# Altium project RGB_Plugin_Board.PrjPCB
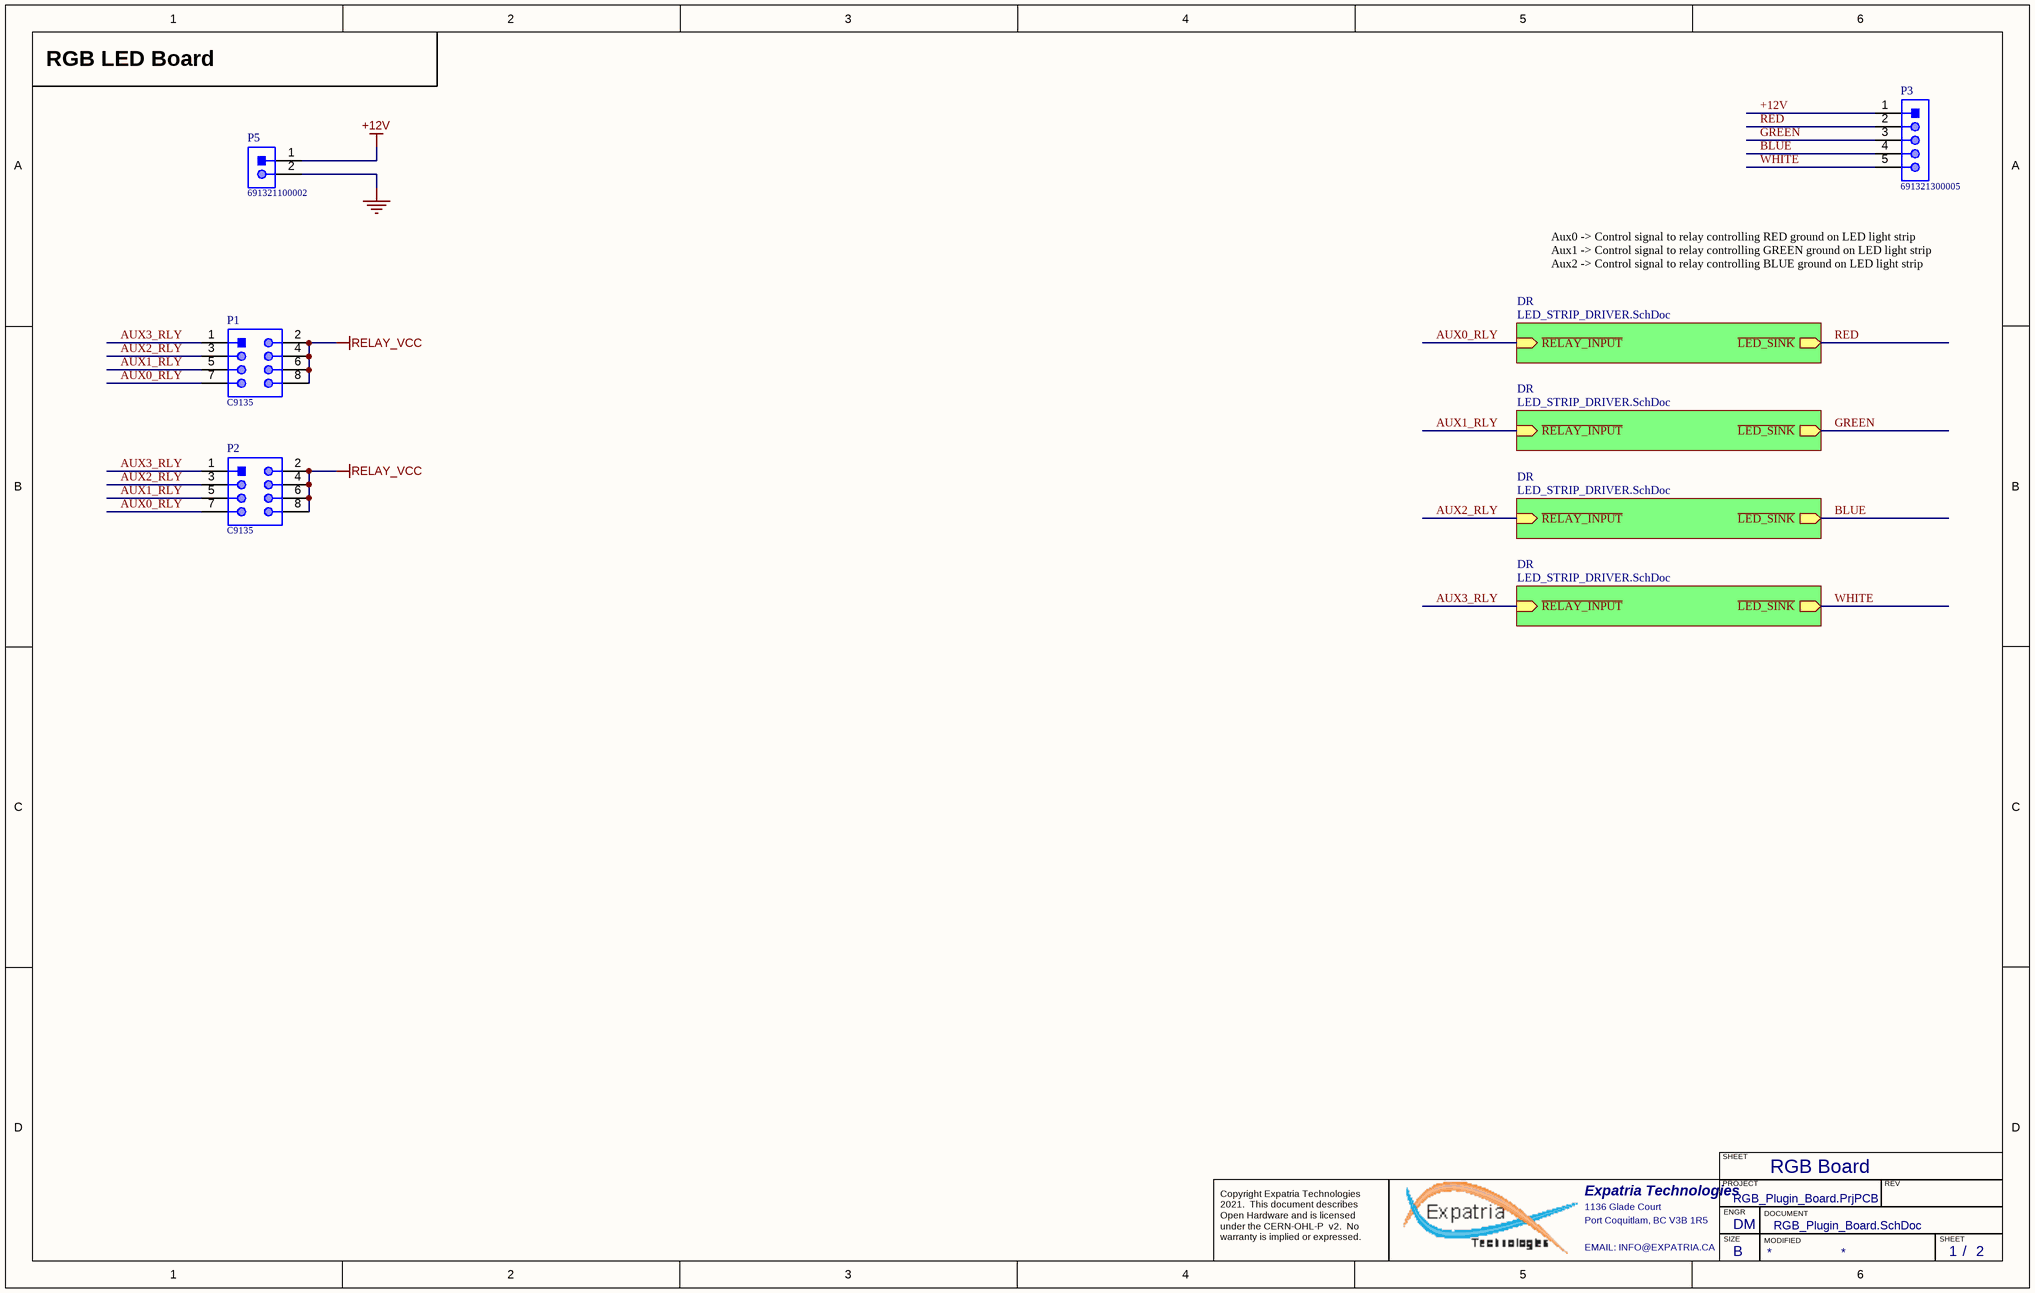
[diagram p0: RGB_Plugin_Board.SchDoc]
PCBPARTNO: RGB_PLUGIN; PCBREVNO: A2; Title: RGB_PLUGIN; VarRevNo: A2
2 sheets, 20 parts. Net scope: hierarchical (ports join the sheet entries above them; power ports are global).
Board file: RGB_Plugin_Board.PcbDoc
Sheets:
  RGB_Plugin_Board.SchDoc
    DR = LED_STRIP_DRIVER.SchDoc
    DR = LED_STRIP_DRIVER.SchDoc
    DR = LED_STRIP_DRIVER.SchDoc
    DR = LED_STRIP_DRIVER.SchDoc

## Sheet RGB_Plugin_Board.SchDoc: Bluebell MFG PCB
size B; Author: AM; CompanyName: Cambridge Mobile Telematics; DrawnBy: A.Marles; Engineer: DM; Organization: Silver Bullet Technology; Address1: Schematic; Address2: 101 Main Street, 14th Floor; Address3: Cambridge, MA 02142; Address4: USA; DocumentNumber: 1; Revision: A2; SheetNumber: 1; SheetTotal: 2

### Parts
P1  C9135  [61200821621]
P2  C9135  [61200821621]
P3  691321300005  [691321300005]
P5  691321100002  [691321100002]

### Sub-sheets
DR = LED_STRIP_DRIVER.SchDoc: ~{LED_SINK} (out), ~{RELAY_INPUT} (in)
DR = LED_STRIP_DRIVER.SchDoc: ~{LED_SINK} (out), ~{RELAY_INPUT} (in)
DR = LED_STRIP_DRIVER.SchDoc: ~{LED_SINK} (out), ~{RELAY_INPUT} (in)
DR = LED_STRIP_DRIVER.SchDoc: ~{LED_SINK} (out), ~{RELAY_INPUT} (in)

### Nets
+12V: P3.1 P5.1
GND: P5.2
RELAY_VCC: P1.2 P1.4 P1.6 P1.8 P2.2 P2.4 P2.6 P2.8
AUX0_RLY: P1.7 P2.7 ; sheet DR/~{RELAY_INPUT}
AUX1_RLY: P1.5 P2.5 ; sheet DR/~{RELAY_INPUT}
AUX2_RLY: P1.3 P2.3 ; sheet DR/~{RELAY_INPUT}
AUX3_RLY: P1.1 P2.1 ; sheet DR/~{RELAY_INPUT}
BLUE: P3.4 ; sheet DR/~{LED_SINK}
GREEN: P3.3 ; sheet DR/~{LED_SINK}
RED: P3.2 ; sheet DR/~{LED_SINK}
WHITE: P3.5 ; sheet DR/~{LED_SINK}

### Notes on the sheet
- RGB LED Board
- Aux0 -> Control signal to relay controlling RED ground on LED light strip
  Aux1 -> Control signal to relay controlling GREEN ground on LED light strip
  Aux2 -> Control signal to relay controlling BLUE ground on LED light strip
- RGB Board
- SHEET
- Expatria Technologies
- 1136 Glade Court
- Port Coquitlam, BC V3B 1R5
- PROJECT
- SIZE
- ENGR
- MODIFIED
- DOCUMENT
- REV
- Copyright Expatria Technologies 2021.  This document describes Open Hardware and is licensed under the CERN-OHL-P  v2.  No warranty is implied or expressed.
- EMAIL: INFO@EXPATRIA.CA
- B
- /

### Library data of the parts
P1 P2 = CMP-1502-00006-1: Male Box Header WR-BHD, THT, Vertical, pitch 2.54 mm, 8 pins; Manufacturer: Wurth Elektronik; Pitch: 2.54mm; Publisher: WurthElektronik; Part Number: C9135; Packaging: Tray; Published Date: August2018; Package Reference: 61200821621; SuppliersPartNumber: C9135
P3 = CMP-1502-01866-1: Serie 321 - 3.81mm Vertical PCB Header WR-TBL, 5 pin; Manufacturer: Wurth Elektronik; Gender: Male; Pin Number: 5; Packaging: Box; Package Reference: 691321300005; Mounting Technology: THT; Operating Temperature: -40to105degC; Pitch: 3.81mm; Manufacturer URL: http://www.we-online.de; Datasheet URL: http://katalog.we-online.de/em/datasheet/6913213000xx.pdf; Publisher: WurthElektronik; Part Number: 691321300005
P5 = CMP-1502-01783-1: Serie 3211 - 3.50mm Vertical PCB Header WR-TBL, 2 pin; Manufacturer: Wurth Elektronik; Gender: Male; Pin Number: 2; Part Number: 691321100002; Mounting Technology: THT; Manufacturer URL: http://www.we-online.de; Datasheet URL: http://katalog.we-online.de/em/datasheet/6913211000xx.pdf; Packaging: Box; Package Reference: 691321100002; Publisher: WurthElektronik; Pitch: 3.50mm; Operating Temperature: -40to105degC

## Sheet LED_STRIP_DRIVER.SchDoc: RGB_PLUGIN
size B; DocumentNumber: 2; SheetNumber: 2; SheetTotal: 2
Used 4 times, as channels DR, DR, DR, DR. Parts and nets are listed once, with the designators drawn on the sheet.
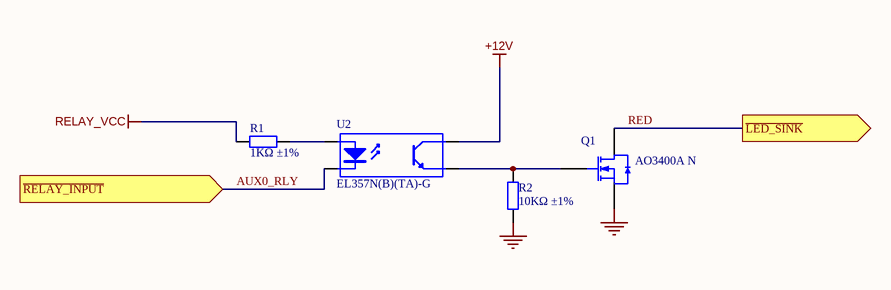
[diagram p1: LED_STRIP_DRIVER.SchDoc]

### Parts
Q1  AO3400A N  [SOT-23-3L]
R1  1KΩ ±1%  [0402_R]
R2  10KΩ ±1%  [0402_R]
U2  EL357N(B)(TA)-G  [SOP-4_P2.54]

### Ports
~{LED_SINK} (out), ~{RELAY_INPUT} (in)

### Nets
+12V: U2.4(C)
GND: Q1.2(S) R2.1
RELAY_VCC: R1.1
AUX0_RLY: U2.2(K) ; port ~{RELAY_INPUT}
RED: Q1.3(D) ; port ~{LED_SINK}
NetQ1_1: Q1.1(G) R2.2 U2.3(E)
NetR1_2: R1.2 U2.1(A)

### Channels
DR: designators end in _DRC; ports ~{LED_SINK}=RED ~{RELAY_INPUT}=AUX0_RLY
DR: designators end in _DRB; ports ~{LED_SINK}=GREEN ~{RELAY_INPUT}=AUX1_RLY
DR: designators end in _DRA; ports ~{LED_SINK}=BLUE ~{RELAY_INPUT}=AUX2_RLY
DR: designators end in _DRD; ports ~{LED_SINK}=WHITE ~{RELAY_INPUT}=AUX3_RLY

### Notes on the sheet
- SHEET
- Expatria Technologies
- 1136 Glade Court
- Port Coquitlam, BC V3B 1R5
- PROJECT
- SIZE
- ENGR
- MODIFIED
- DOCUMENT
- REV
- Copyright Expatria Technologies 2021.  This document describes Open Hardware and is licensed under the CERN-OHL-P  v2.  No warranty is implied or expressed.
- EMAIL: INFO@EXPATRIA.CA
- B
- /

### Library data of the parts
Q1 = AO3400A N道沟 X0YV1T SOT-23: MOS(场效应管); ComponentLink1Description: 供应商链接; ComponentLink1URL: http://www.szlcsc.com/product/details_21629.html; Package: SOT-23; Supplier: LC; SuppliersPartNumber: C20917
R1 = 0402 1K (1001) 1%: Chip resistor; Manufacturer: Uniroyal Elec; PartNumber: 0402WGF1001TCE; Power: 1/16W; ComponentLink1Description: Supplier link; ComponentLink1URL: http://www.szlcsc.com/product/details_12256.html; Package: 0402; Supplier: LC; SuppliersPartNumber: C11702; Resistance: 1KΩ; Tolerance: 1%
R2 = 0402 10K (1002) 1%: Chip resistor; Manufacturer: Uniroyal Elec; PartNumber: 0402WGF1002TCE; Power: 1/16W; ComponentLink1Description: Supplier link; ComponentLink1URL: http://www.szlcsc.com/product/details_26487.html; Package: 0402; Supplier: LC; SuppliersPartNumber: C25744; Resistance: 10KΩ; Tolerance: 1%
U2 = EL357N(B)(TA)-G_[C6649]: Optocoupler SOP-4, EL357N(B)(TA)-G, Everlight Electronics; ComponentLink1Description: 供应商链接; ComponentLink1URL: http://www.szlcsc.com/product/details_7114.html; Package: SOP-4_P2.54; Supplier: LC; SuppliersPartNumber: C6649; Manufacturer 1: Everlight; Manufacturer Part Number 1: EL357N(B)(TA)-G

## Nets that join several sheets
+12V: RGB_Plugin_Board (P3.1 P5.1), DR (U2_DRC.4), DR (U2_DRB.4), DR (U2_DRA.4), DR (U2_DRD.4)
GND: RGB_Plugin_Board (P5.2), DR (Q1_DRC.2 R2_DRC.1), DR (Q1_DRB.2 R2_DRB.1), DR (Q1_DRA.2 R2_DRA.1), DR (Q1_DRD.2 R2_DRD.1)
RELAY_VCC: RGB_Plugin_Board (8 pins), DR (R1_DRC.1), DR (R1_DRB.1), DR (R1_DRA.1), DR (R1_DRD.1)
AUX0_RLY: RGB_Plugin_Board (P1.7 P2.7), DR (U2_DRC.2)
AUX1_RLY: RGB_Plugin_Board (P1.5 P2.5), DR (U2_DRB.2)
AUX2_RLY: RGB_Plugin_Board (P1.3 P2.3), DR (U2_DRA.2)
AUX3_RLY: RGB_Plugin_Board (P1.1 P2.1), DR (U2_DRD.2)
BLUE: RGB_Plugin_Board (P3.4), DR (Q1_DRA.3)
GREEN: RGB_Plugin_Board (P3.3), DR (Q1_DRB.3)
RED: RGB_Plugin_Board (P3.2), DR (Q1_DRC.3)
WHITE: RGB_Plugin_Board (P3.5), DR (Q1_DRD.3)

## Assembly variants
Debug: not fitted J1 L1 P1 P2 P4 P5 P7 P10 R23 R25
Production: not fitted J1 L1 P4 P7 P10 Q2 R23 R25 TL1 TL2 TL3 TL4 TL5 TL6 TL7 TL8
Reduced 3D model: not fitted C1 C5 C14 C16 C19 DR2 R1 R2 R6 R7 R9 R10 R11 R12 R13 R14 R18 R19 R21 R22 R23 R26 R27 R28 R29 R30 R31